# EAGLE design christmas_card (EAGLE 9.6.2)

## Sheet 1 of 2
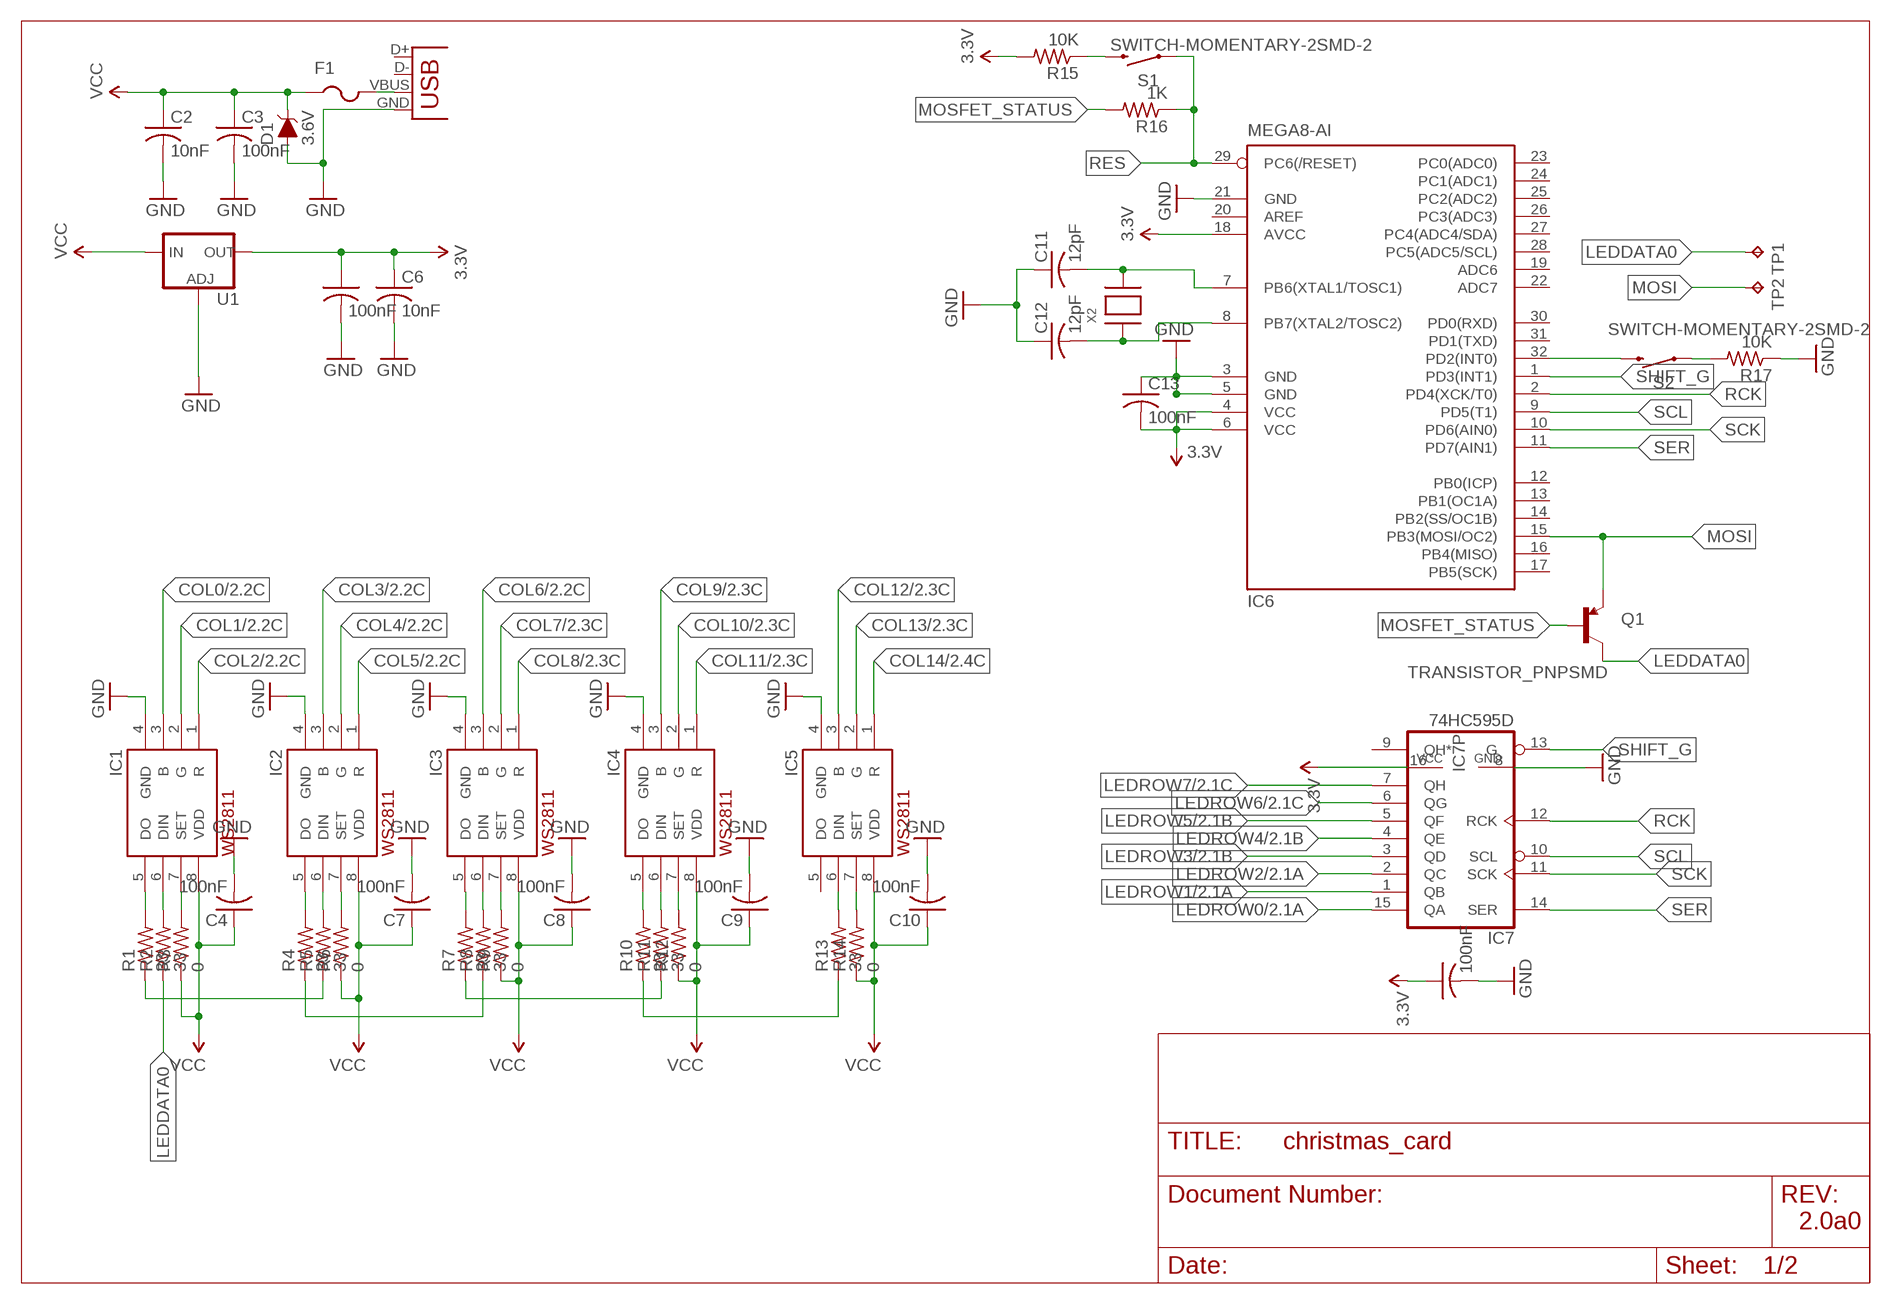
[diagram p0: schematic, sheet 1]

### Parts
C2  10nF  C-USC0603  [C0603]
C3  100nF  C-USC0603  [C0603]
C4  100nF  C-USC0603  [C0603]
C5  100nF  C-USC0603  [C0603]
C6  10nF  C-USC0603  [C0603]
C7  100nF  C-USC0603  [C0603]
C8  100nF  C-USC0603  [C0603]
C9  100nF  C-USC0603  [C0603]
C10  100nF  C-USC0603  [C0603]
C11  12pF  C-USC0603  [C0603]
C12  12pF  C-USC0603  [C0603]
C13  100nF  C-USC0603  [C0603]
C14  100nF  C-USC0603  [C0603]
D1  3.6V  DIODE-ZENER-BZT52C3V6S  [SOD-323]
F1  PTCFUSE-1206  [R1206]
IC1  WS2811-SOP8  [SO08-SKINNYPADS]
IC2  WS2811-SOP8  [SO08-SKINNYPADS]
IC3  WS2811-SOP8  [SO08-SKINNYPADS]
IC4  WS2811-SOP8  [SO08-SKINNYPADS]
IC5  WS2811-SOP8  [SO08-SKINNYPADS]
IC6  MEGA8-AI  [TQFP32-08]
IC7  74HC595D  [SO16]
Q1  TRANSISTOR_PNPSMD  [SOT23-3]
R1  33  R-US_R0603  [R0603]
R2  33  R-US_R0603  [R0603]
R3  0  R-US_R0603  [R0603]
R4  33  R-US_R0603  [R0603]
R5  33  R-US_R0603  [R0603]
R6  0  R-US_R0603  [R0603]
R7  33  R-US_R0603  [R0603]
R8  33  R-US_R0603  [R0603]
R9  0  R-US_R0603  [R0603]
R10  33  R-US_R0603  [R0603]
R11  33  R-US_R0603  [R0603]
R12  0  R-US_R0603  [R0603]
R13  33  R-US_R0603  [R0603]
R14  0  R-US_R0603  [R0603]
R15  10K  R-US_R0603  [R0603]
R16  1K  R-US_R0603  [R0603]
R17  10K  R-US_R0603  [R0603]
S1  SWITCH-MOMENTARY-2SMD-2  [TACTILE_SWITCH_SMD-2]
S2  SWITCH-MOMENTARY-2SMD-2  [TACTILE_SWITCH_SMD-2]
TP1  TPB1,27  [B1,27]
TP2  TPB1,27  [B1,27]
U1  V_REG_LM1117SOT223  [SOT223]
X1  USB-MICROB  [USB-MICROB]
X2  XTALNX5032  [NX5032]

### Nets
3.3V: C5.1 C6.1 C13.2 C14.1 IC6.4(VCC) IC6.6(VCC) IC6.18(AVCC) IC7.16(VCC) R15.2 U1.2(OUT) U1.4(OUT)
COL0: IC1.3(B) ; also sheet 2
COL1: IC1.2(G) ; also sheet 2
COL2: IC1.1(R) ; also sheet 2
COL3: IC2.3(B) ; also sheet 2
COL4: IC2.2(G) ; also sheet 2
COL5: IC2.1(R) ; also sheet 2
COL6: IC3.3(B) ; also sheet 2
COL7: IC3.2(G) ; also sheet 2
COL8: IC3.1(R) ; also sheet 2
COL9: IC4.3(B) ; also sheet 2
COL10: IC4.2(G) ; also sheet 2
COL11: IC4.1(R) ; also sheet 2
COL12: IC5.3(B) ; also sheet 2
COL13: IC5.2(G) ; also sheet 2
COL14: IC5.1(R) ; also sheet 2
GND: C2.2 C3.2 C4.2 C5.2 C6.2 C7.2 C8.2 C9.2 C10.2 C11.1 C12.1 C13.1 C14.2 D1.A IC1.4(GND) IC2.4(GND) IC3.4(GND) IC4.4(GND) IC5.4(GND) IC6.3(GND) IC6.5(GND) IC6.21(GND) IC7.8(GND) R17.1 U1.1(ADJ) X1.GND
LEDATA1: R7.1 R11.1
LEDDATA0: Q1.3(C) R2.1 TP1.TP
LEDROW0: IC7.15(QA) ; also sheet 2
LEDROW1: IC7.1(QB) ; also sheet 2
LEDROW2: IC7.2(QC) ; also sheet 2
LEDROW3: IC7.3(QD) ; also sheet 2
LEDROW4: IC7.4(QE) ; also sheet 2
LEDROW5: IC7.5(QF) ; also sheet 2
LEDROW6: IC7.6(QG) ; also sheet 2
LEDROW7: IC7.7(QH) ; also sheet 2
MOSFET_STATUS: Q1.1(B) R16.2
MOSI: IC6.15(PB3(MOSI/OC2)) Q1.2(E) TP2.TP
N$1: R1.1 R5.1
N$2: IC1.5(DO) R1.2
N$3: IC2.6(DIN) R5.2
N$4: IC2.5(DO) R4.2
N$5: R4.1 R8.1
N$6: IC3.6(DIN) R8.2
N$7: IC1.6(DIN) R2.2
N$8: IC3.7(SET) R9.2
N$9: R15.1 S1.1
N$10: C11.2 IC6.7(PB6(XTAL1/TOSC1)) X2.P$2
N$11: IC6.32(PD2(INT0)) S2.1
N$12: R17.2 S2.2
N$14: C12.2 IC6.8(PB7(XTAL2/TOSC2)) X2.P$1
N$24: R10.1 R13.1
N$32: IC4.6(DIN) R11.2
N$33: IC4.7(SET) R12.2
N$34: IC3.5(DO) R7.2
N$35: IC2.7(SET) R6.2
N$36: IC1.7(SET) R3.2
N$37: IC5.6(DIN) R13.2
N$38: IC5.7(SET) R14.2
N$41: F1.2 X1.VBUS
N$42: IC4.5(DO) R10.2
RCK: IC6.2(PD4(XCK/T0)) IC7.12(RCK)
RES: IC6.29(PC6(/RESET)) R16.1 S1.2
SCK: IC6.10(PD6(AIN0)) IC7.11(SCK)
SCL: IC6.9(PD5(T1)) IC7.10(SCL)
SER: IC6.11(PD7(AIN1)) IC7.14(SER)
SHIFT_G: IC6.1(PD3(INT1)) IC7.13(G)
VCC: C2.1 C3.1 C4.1 C7.1 C8.1 C9.1 C10.1 D1.C F1.1 IC1.8(VDD) IC2.8(VDD) IC3.8(VDD) IC4.8(VDD) IC5.8(VDD) R3.1 R6.1 R9.1 R12.1 R14.1 U1.3(IN)
Unconnected: IC5.5(DO) IC6.12(PB0(ICP)) IC6.13(PB1(OC1A)) IC6.14(PB2(SS/OC1B)) IC6.16(PB4(MISO)) IC6.17(PB5(SCK)) IC6.19(ADC6) IC6.20(AREF) IC6.22(ADC7) IC6.23(PC0(ADC0)) IC6.24(PC1(ADC1)) IC6.25(PC2(ADC2)) IC6.26(PC3(ADC3)) IC6.27(PC4(ADC4/SDA)) IC6.28(PC5(ADC5/SCL)) IC6.30(PD0(RXD)) IC6.31(PD1(TXD)) IC7.9(QH*) X1.D+ X1.D-

### Notes on the sheet
- 2.0a0

## Sheet 2 of 2
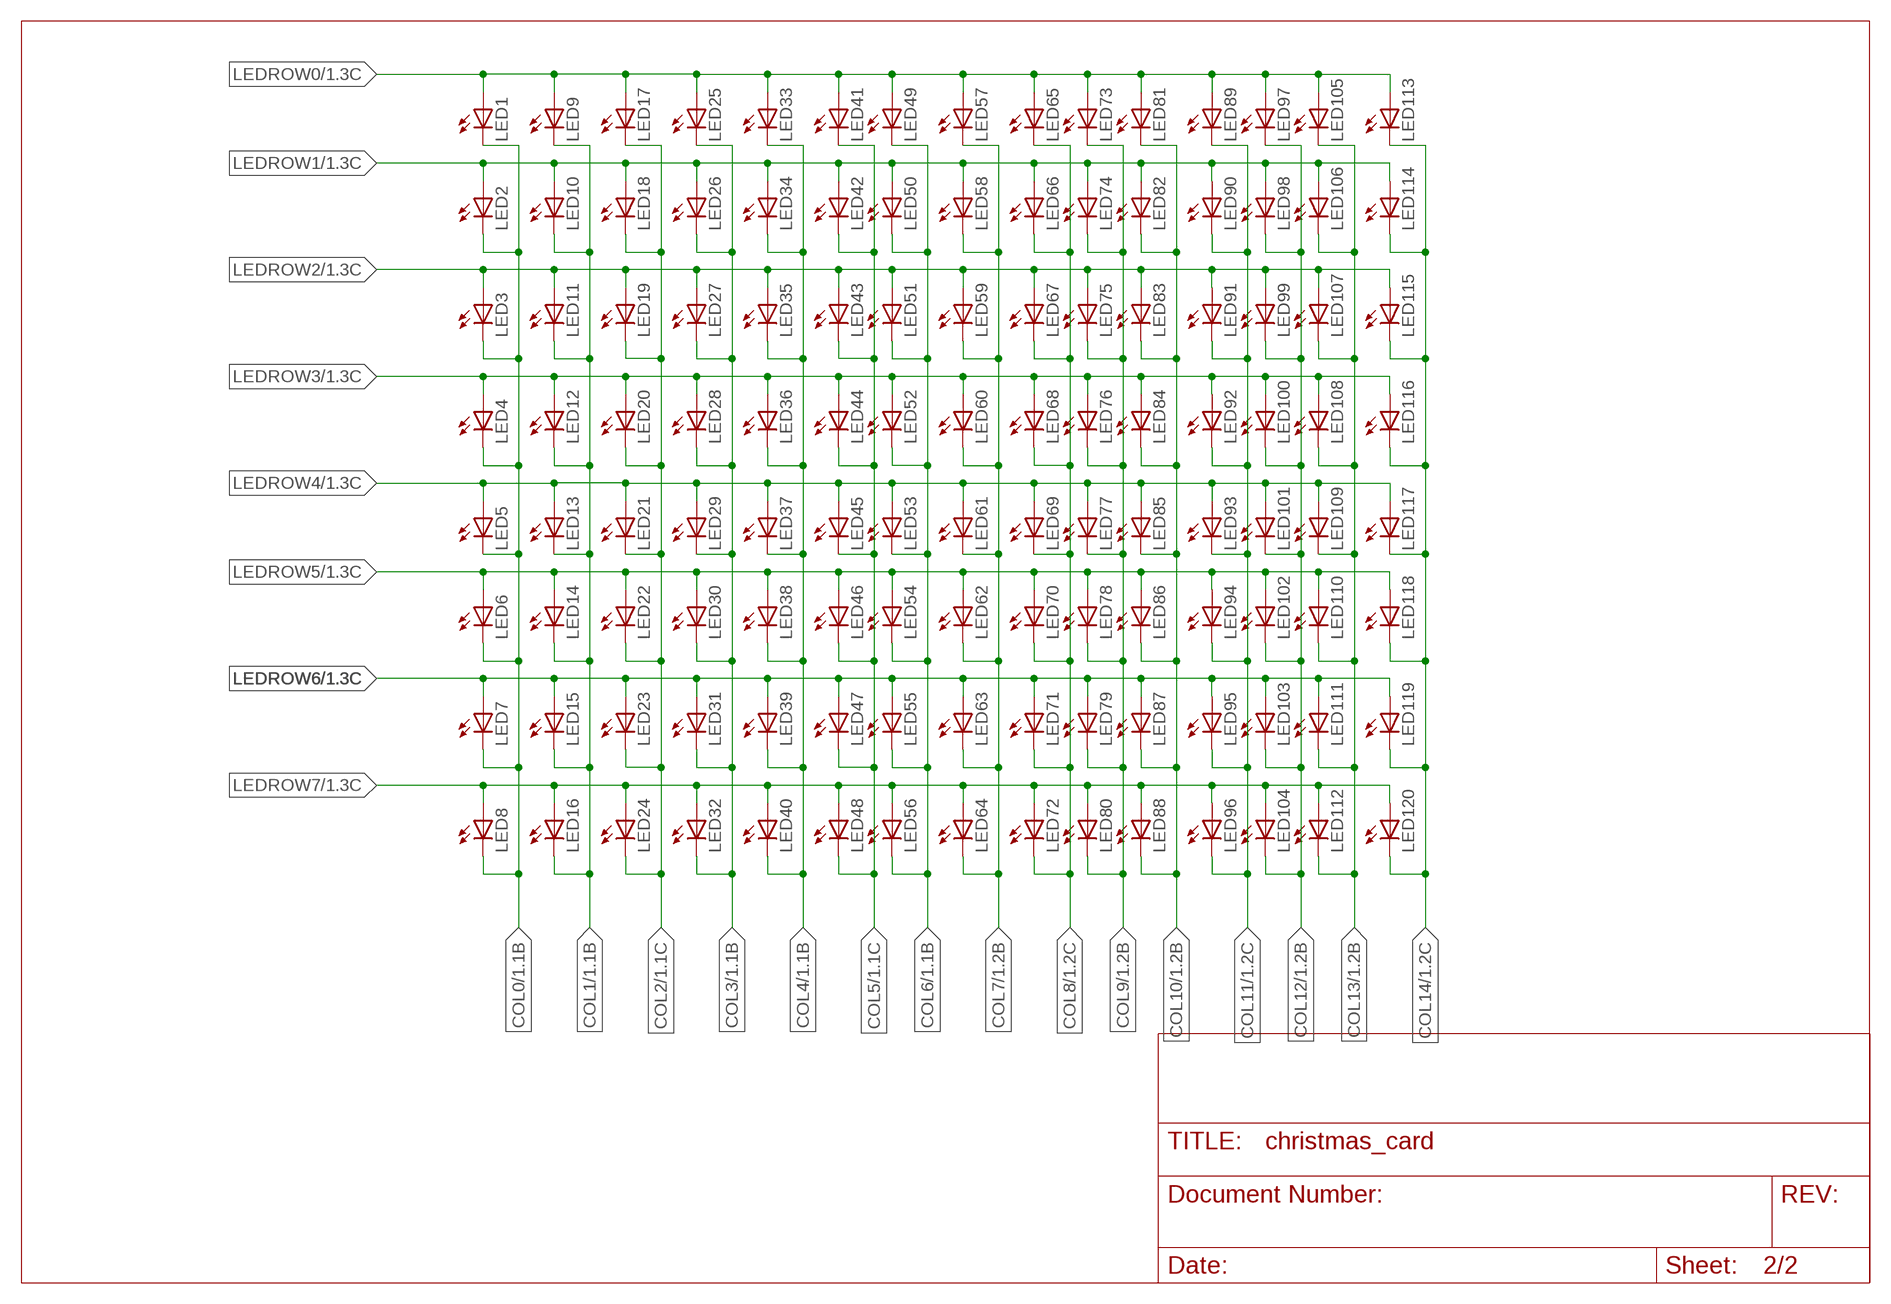
[diagram p1: schematic, sheet 2]

### Parts
LED1  LED1206  [LED-1206]
LED2  LED1206  [LED-1206]
LED3  LED1206  [LED-1206]
LED4  LED1206  [LED-1206]
LED5  LED1206  [LED-1206]
LED6  LED1206  [LED-1206]
LED7  LED1206  [LED-1206]
LED8  LED1206  [LED-1206]
LED9  LED1206  [LED-1206]
LED10  LED1206  [LED-1206]
LED11  LED1206  [LED-1206]
LED12  LED1206  [LED-1206]
LED13  LED1206  [LED-1206]
LED14  LED1206  [LED-1206]
LED15  LED1206  [LED-1206]
LED16  LED1206  [LED-1206]
LED17  LED1206  [LED-1206]
LED18  LED1206  [LED-1206]
LED19  LED1206  [LED-1206]
LED20  LED1206  [LED-1206]
LED21  LED1206  [LED-1206]
LED22  LED1206  [LED-1206]
LED23  LED1206  [LED-1206]
LED24  LED1206  [LED-1206]
LED25  LED1206  [LED-1206]
LED26  LED1206  [LED-1206]
LED27  LED1206  [LED-1206]
LED28  LED1206  [LED-1206]
LED29  LED1206  [LED-1206]
LED30  LED1206  [LED-1206]
LED31  LED1206  [LED-1206]
LED32  LED1206  [LED-1206]
LED33  LED1206  [LED-1206]
LED34  LED1206  [LED-1206]
LED35  LED1206  [LED-1206]
LED36  LED1206  [LED-1206]
LED37  LED1206  [LED-1206]
LED38  LED1206  [LED-1206]
LED39  LED1206  [LED-1206]
LED40  LED1206  [LED-1206]
LED41  LED1206  [LED-1206]
LED42  LED1206  [LED-1206]
LED43  LED1206  [LED-1206]
LED44  LED1206  [LED-1206]
LED45  LED1206  [LED-1206]
LED46  LED1206  [LED-1206]
LED47  LED1206  [LED-1206]
LED48  LED1206  [LED-1206]
LED49  LED1206  [LED-1206]
LED50  LED1206  [LED-1206]
LED51  LED1206  [LED-1206]
LED52  LED1206  [LED-1206]
LED53  LED1206  [LED-1206]
LED54  LED1206  [LED-1206]
LED55  LED1206  [LED-1206]
LED56  LED1206  [LED-1206]
LED57  LED1206  [LED-1206]
LED58  LED1206  [LED-1206]
LED59  LED1206  [LED-1206]
LED60  LED1206  [LED-1206]
LED61  LED1206  [LED-1206]
LED62  LED1206  [LED-1206]
LED63  LED1206  [LED-1206]
LED64  LED1206  [LED-1206]
LED65  LED1206  [LED-1206]
LED66  LED1206  [LED-1206]
LED67  LED1206  [LED-1206]
LED68  LED1206  [LED-1206]
LED69  LED1206  [LED-1206]
LED70  LED1206  [LED-1206]
LED71  LED1206  [LED-1206]
LED72  LED1206  [LED-1206]
LED73  LED1206  [LED-1206]
LED74  LED1206  [LED-1206]
LED75  LED1206  [LED-1206]
LED76  LED1206  [LED-1206]
LED77  LED1206  [LED-1206]
LED78  LED1206  [LED-1206]
LED79  LED1206  [LED-1206]
LED80  LED1206  [LED-1206]
LED81  LED1206  [LED-1206]
LED82  LED1206  [LED-1206]
LED83  LED1206  [LED-1206]
LED84  LED1206  [LED-1206]
LED85  LED1206  [LED-1206]
LED86  LED1206  [LED-1206]
LED87  LED1206  [LED-1206]
LED88  LED1206  [LED-1206]
LED89  LED1206  [LED-1206]
LED90  LED1206  [LED-1206]
LED91  LED1206  [LED-1206]
LED92  LED1206  [LED-1206]
LED93  LED1206  [LED-1206]
LED94  LED1206  [LED-1206]
LED95  LED1206  [LED-1206]
LED96  LED1206  [LED-1206]
LED97  LED1206  [LED-1206]
LED98  LED1206  [LED-1206]
LED99  LED1206  [LED-1206]
LED100  LED1206  [LED-1206]
LED101  LED1206  [LED-1206]
LED102  LED1206  [LED-1206]
LED103  LED1206  [LED-1206]
LED104  LED1206  [LED-1206]
LED105  LED1206  [LED-1206]
LED106  LED1206  [LED-1206]
LED107  LED1206  [LED-1206]
LED108  LED1206  [LED-1206]
LED109  LED1206  [LED-1206]
LED110  LED1206  [LED-1206]
LED111  LED1206  [LED-1206]
LED112  LED1206  [LED-1206]
LED113  LED1206  [LED-1206]
LED114  LED1206  [LED-1206]
LED115  LED1206  [LED-1206]
LED116  LED1206  [LED-1206]
LED117  LED1206  [LED-1206]
LED118  LED1206  [LED-1206]
LED119  LED1206  [LED-1206]
LED120  LED1206  [LED-1206]

### Nets
COL0: LED1.C LED2.C LED3.C LED4.C LED5.C LED6.C LED7.C LED8.C ; also sheet 1
COL1: LED9.C LED10.C LED11.C LED12.C LED13.C LED14.C LED15.C LED16.C ; also sheet 1
COL2: LED17.C LED18.C LED19.C LED20.C LED21.C LED22.C LED23.C LED24.C ; also sheet 1
COL3: LED25.C LED26.C LED27.C LED28.C LED29.C LED30.C LED31.C LED32.C ; also sheet 1
COL4: LED33.C LED34.C LED35.C LED36.C LED37.C LED38.C LED39.C LED40.C ; also sheet 1
COL5: LED41.C LED42.C LED43.C LED44.C LED45.C LED46.C LED47.C LED48.C ; also sheet 1
COL6: LED49.C LED50.C LED51.C LED52.C LED53.C LED54.C LED55.C LED56.C ; also sheet 1
COL7: LED57.C LED58.C LED59.C LED60.C LED61.C LED62.C LED63.C LED64.C ; also sheet 1
COL8: LED65.C LED66.C LED67.C LED68.C LED69.C LED70.C LED71.C LED72.C ; also sheet 1
COL9: LED73.C LED74.C LED75.C LED76.C LED77.C LED78.C LED79.C LED80.C ; also sheet 1
COL10: LED81.C LED82.C LED83.C LED84.C LED85.C LED86.C LED87.C LED88.C ; also sheet 1
COL11: LED89.C LED90.C LED91.C LED92.C LED93.C LED94.C LED95.C LED96.C ; also sheet 1
COL12: LED97.C LED98.C LED99.C LED100.C LED101.C LED102.C LED103.C LED104.C ; also sheet 1
COL13: LED105.C LED106.C LED107.C LED108.C LED109.C LED110.C LED111.C LED112.C ; also sheet 1
COL14: LED113.C LED114.C LED115.C LED116.C LED117.C LED118.C LED119.C LED120.C ; also sheet 1
LEDROW0: LED1.A LED9.A LED17.A LED25.A LED33.A LED41.A LED49.A LED57.A LED65.A LED73.A LED81.A LED89.A LED97.A LED105.A LED113.A ; also sheet 1
LEDROW1: LED2.A LED10.A LED18.A LED26.A LED34.A LED42.A LED50.A LED58.A LED66.A LED74.A LED82.A LED90.A LED98.A LED106.A LED114.A ; also sheet 1
LEDROW2: LED3.A LED11.A LED19.A LED27.A LED35.A LED43.A LED51.A LED59.A LED67.A LED75.A LED83.A LED91.A LED99.A LED107.A LED115.A ; also sheet 1
LEDROW3: LED4.A LED12.A LED20.A LED28.A LED36.A LED44.A LED52.A LED60.A LED68.A LED76.A LED84.A LED92.A LED100.A LED108.A LED116.A ; also sheet 1
LEDROW4: LED5.A LED13.A LED21.A LED29.A LED37.A LED45.A LED53.A LED61.A LED69.A LED77.A LED85.A LED93.A LED101.A LED109.A LED117.A ; also sheet 1
LEDROW5: LED6.A LED14.A LED22.A LED30.A LED38.A LED46.A LED54.A LED62.A LED70.A LED78.A LED86.A LED94.A LED102.A LED110.A LED118.A ; also sheet 1
LEDROW6: LED7.A LED15.A LED23.A LED31.A LED39.A LED47.A LED55.A LED63.A LED71.A LED79.A LED87.A LED95.A LED103.A LED111.A LED119.A ; also sheet 1
LEDROW7: LED8.A LED16.A LED24.A LED32.A LED40.A LED48.A LED56.A LED64.A LED72.A LED80.A LED88.A LED96.A LED104.A LED112.A LED120.A ; also sheet 1

## Library data of the parts
C2-C14 = adafruit:C-US: CAPACITOR, American symbol
D1 = SparkFun-DiscreteSemi:DIODE-ZENER: Zener Diode A Zener diode allows current to flow from its anode to its cathode like a normal semiconductor diode, but it also permits current to flow in the reverse direction when its "Zener voltage" is reached. - WIkipedia; PROD_ID: DIO-08199
F1 = adafruit:PTCFUSE: PTC fuses, resettable thermistors
IC1-IC5 = adafruit:WS2811
IC6 = atmel:MEGA8: MICROCONTROLLER 8 Kbytes FLASH, 1 kbytes SRAM, 512 bytes EEPROM, USART, 6-channel 10 bit ADC, 2-channel 8 bit ADC Pin compatible with Atmega48, ATMega88, ATMega168 Source: avr.lbr; MPN: ATMEGA8-16AU; OC_FARNELL: 9171371; OC_NEWARK: 73M8863
IC7 = 74xx-eu:74*595: 8-bit SHIFT REGISTER, output latch
LED1-LED120 = SparkFun:LED: LEDs Standard schematic elements and footprints for 5mm, 3mm, 1206, and 0603 sized LEDs. 5mm - Spark Fun Electronics SKU : COM-00529 (and others)
Q1 = SparkFun:TRANSISTOR_PNP
R1-R17 = adafruit:R-US_: RESISTOR, American symbol
S1 S2 = SparkFun:SWITCH-MOMENTARY-2
TP1 TP2 = testpad:TP: Test pad
U1 = SparkFun-IC-Power:V_REG_LM1117: Voltage Regulator LM1117 Standard adjustable voltage regulator but in SMD form. Spark Fun Electronics SKU : COM-00595; PROD_ID: VREG-08170
X1 = SparkFun:USB: USB Connectors USB-B-PTH is fully proven SKU : PRT-00139 USB-miniB is fully proven SKU : PRT-00587 USB-A-PCB is untested. USB-A-H is throughly reviewed, but untested. Spark Fun Electronics SKU : PRT-00437 USB-B-SMT is throughly reviewed, but untested. Needs silkscreen touching up. USB-A-S has not been used/tested USB-MB-H has not been used/tested
X2 = adafruit:XTAL: Low cost SMT crystals, no capacitors included http://www.ladyada.net/library/eagle

## Board
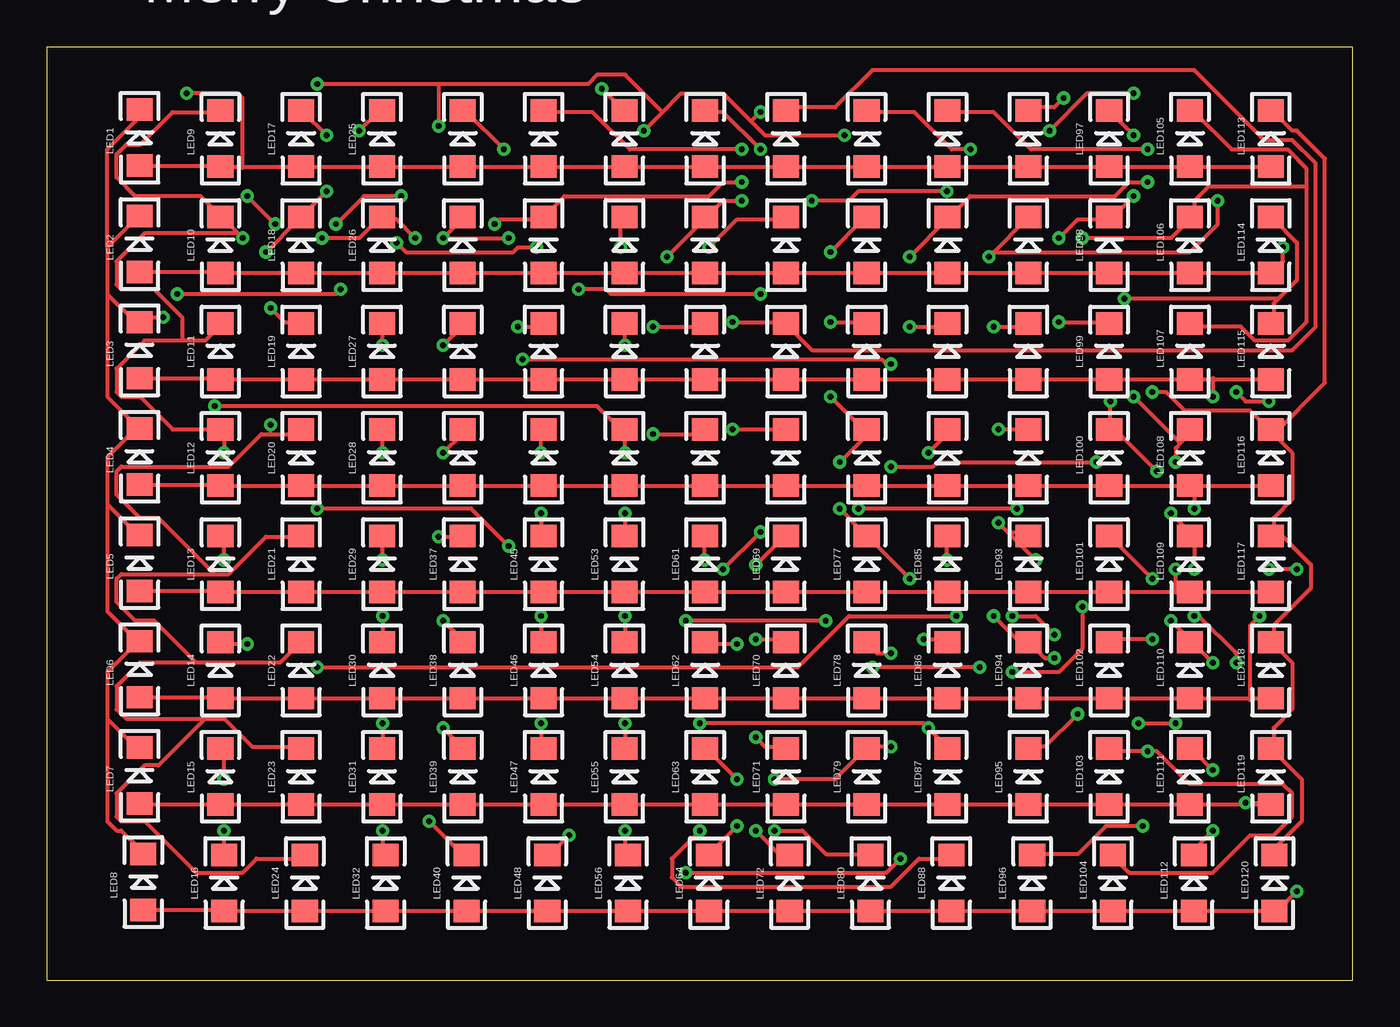
[diagram p2: board, top side]
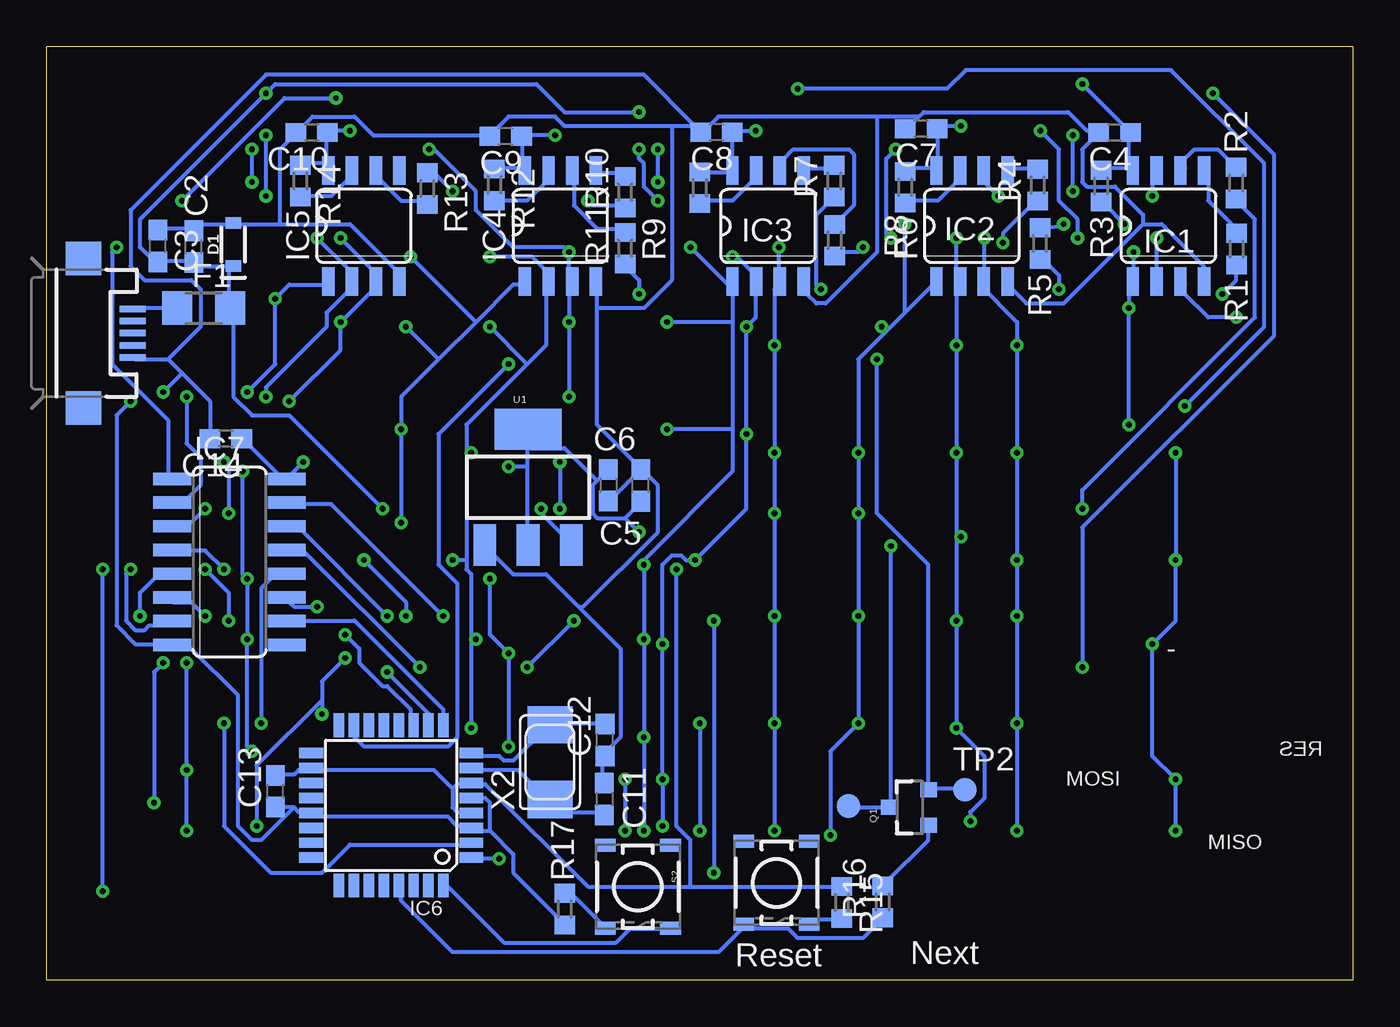
[diagram p3: board, bottom side, seen from below]

Size 70 x 50 mm. Coordinates in mm from the lower left corner, seen from the top.
Outline: 0,0 70,0 70,50 0,50 0,0
Copper layers (1*16): Top 0.035mm / dielectric 1.5mm / Bottom 0.035mm
Design rules "default *": minimum track width 8mil, minimum drill 12mil, track to track 8mil, track to pad 8mil, pad to pad 8mil, via to via 8mil, smd to smd 8mil, copper to edge 40mil, drill to drill 8mil, minimum pad ring 10mil, minimum via ring 8mil, stop-mask expansion 4mil, vias tented up to drill 12mil, thermal gap 10mil

### Footprints (pad centres in the part's own frame; a part is rotated, then mirrored left to right if it is on the bottom)
C0603 = smd 1.1 x 1: 1 -0.85,0; 2 0.85,0
SOD-323 = smd 0.63 x 0.83: A 1.15,0; C -1.15,0
R1206 = smd 1.6 x 1.803: 1 -1.422,0; 2 1.422,0
SO08-SKINNYPADS = smd 0.66 x 1.524: 1 -1.905,-2.973; 2 -0.635,-2.973; 3 0.635,-2.973; 4 1.905,-2.973; 5 1.905,2.973; 6 0.635,2.973; 7 -0.635,2.973; 8 -1.905,2.973
TQFP32-08 = smd 1.27 x 0.559: 1 -4.293,2.8; 2 -4.293,2; 3 -4.293,1.2; 4 -4.293,0.4; 5 -4.293,-0.4; 6 -4.293,-1.2; 7 -4.293,-2; 8 -4.293,-2.8; 17 4.293,-2.8; 18 4.293,-2; 19 4.293,-1.2; 20 4.293,-0.4; 21 4.293,0.4; 22 4.293,1.2; 23 4.293,2; 24 4.293,2.8 | smd 0.559 x 1.27: 9 -2.8,-4.293; 10 -2,-4.293; 11 -1.2,-4.293; 12 -0.4,-4.293; 13 0.4,-4.293; 14 1.2,-4.293; 15 2,-4.293; 16 2.8,-4.293; 25 2.8,4.293; 26 2,4.293; 27 1.2,4.293; 28 0.4,4.293; 29 -0.4,4.293; 30 -1.2,4.293; 31 -2,4.293; 32 -2.8,4.293
SO16 = smd 0.66 x 2.032: 1 -4.445,-3.073; 2 -3.175,-3.073; 3 -1.905,-3.073; 4 -0.635,-3.073; 5 0.635,-3.073; 6 1.905,-3.073; 7 3.175,-3.073; 8 4.445,-3.073; 9 4.445,3.073; 10 3.175,3.073; 11 1.905,3.073; 12 0.635,3.073; 13 -0.635,3.073; 14 -1.905,3.073; 15 -3.175,3.073; 16 -4.445,3.073
LED-1206 = smd 1.2 x 1.4: A -1.5,0; C 1.5,0
SOT23-3 = smd 0.8 x 0.9: 1 -0.95,-1; 2 0.95,-1; 3 0,1.1
R0603 = smd 1 x 1.1: 1 -0.85,0; 2 0.85,0
TACTILE_SWITCH_SMD-2 = smd 0.7 x 1.1: 1 2.225,1.75; 2 2.225,-1.75; 3 -2.225,-1.75; 4 -2.225,1.75
B1,27 = smd 1.27 x 1.27: TP 0,0
SOT223 = smd 1.219 x 2.235: 1 -2.311,-3.099; 2 0,-3.099; 3 2.311,-3.099 | smd 3.6 x 2.2: 4 0,3.099
USB-MICROB = smd 0.35 x 1.4: D+ 0,2.65; D- -0.65,2.65; GND 1.3,2.65; ID 0.65,2.65; VBUS -1.3,2.65 | smd 1.8 x 1.9: MT1 -4,0; MT2 4,0
NX5032 = smd 2 x 2.4: P$1 2,0; P$2 -2,0

### Placement (x,y rotation side)
C2  62.11,39.29 90 bottom
C3  64.03,39.32 90 bottom
C4  12.77,45.4 180 bottom
C5  38.16,26.5 90 bottom
C6  39.9,26.5 270 bottom
C7  23.13,45.6 180 bottom
C8  34.1,45.42 180 bottom
C9  45.4,45.2 180 bottom
C10  55.8,45.4 180 bottom
C11  40.12,9.69 270 bottom
C12  40.07,12.86 90 bottom
C13  57.73,10.11 90 bottom
C14  60.4,29 180 bottom
D1  60,39.4 90 bottom
F1  61.59,35.99 180 bottom
IC1  9.88,40.4 0 bottom
IC2  20.41,40.4 0 bottom
IC3  31.34,40.4 0 bottom
IC4  42.47,40.4 0 bottom
IC5  53,40.4 0 bottom
IC6  51.53,9.35 180 bottom
IC7  60.2,22.4 270 bottom
LED1  4.98,45.13 90 top
LED2  4.98,39.43 90 top
LED3  4.98,33.73 90 top
LED4  4.98,28.04 90 top
LED5  4.98,22.34 90 top
LED6  4.98,16.65 90 top
LED7  4.98,10.95 90 top
LED8  5.18,5.25 90 top
LED9  9.31,45.07 90 top
LED10  9.31,39.38 90 top
LED11  9.31,33.68 90 top
LED12  9.31,27.98 90 top
LED13  9.31,22.29 90 top
LED14  9.31,16.59 90 top
LED15  9.31,10.9 90 top
LED16  9.51,5.2 90 top
LED17  13.64,45.07 90 top
LED18  13.64,39.38 90 top
LED19  13.64,33.68 90 top
LED20  13.64,27.98 90 top
LED21  13.64,22.29 90 top
LED22  13.64,16.59 90 top
LED23  13.64,10.9 90 top
LED24  13.84,5.2 90 top
LED25  17.97,45.07 90 top
LED26  17.97,39.38 90 top
LED27  17.97,33.68 90 top
LED28  17.97,27.98 90 top
LED29  17.97,22.29 90 top
LED30  17.97,16.59 90 top
LED31  17.97,10.9 90 top
LED32  18.17,5.2 90 top
LED33  22.3,45.07 90 top
LED34  22.3,39.38 90 top
LED35  22.3,33.68 90 top
LED36  22.3,27.98 90 top
LED37  22.3,22.29 90 top
LED38  22.3,16.59 90 top
LED39  22.3,10.9 90 top
LED40  22.5,5.2 90 top
LED41  26.63,45.07 90 top
LED42  26.63,39.38 90 top
LED43  26.63,33.68 90 top
LED44  26.63,27.98 90 top
LED45  26.63,22.29 90 top
LED46  26.63,16.59 90 top
LED47  26.63,10.9 90 top
LED48  26.83,5.2 90 top
LED49  30.96,45.07 90 top
LED50  30.96,39.38 90 top
LED51  30.96,33.68 90 top
LED52  30.96,27.98 90 top
LED53  30.96,22.29 90 top
LED54  30.96,16.59 90 top
LED55  30.96,10.9 90 top
LED56  31.16,5.2 90 top
LED57  35.29,45.07 90 top
LED58  35.29,39.38 90 top
LED59  35.29,33.68 90 top
LED60  35.29,27.98 90 top
LED61  35.29,22.29 90 top
LED62  35.29,16.59 90 top
LED63  35.29,10.9 90 top
LED64  35.49,5.2 90 top
LED65  39.62,45.07 90 top
LED66  39.62,39.38 90 top
LED67  39.62,33.68 90 top
LED68  39.62,27.98 90 top
LED69  39.62,22.29 90 top
LED70  39.62,16.59 90 top
LED71  39.62,10.9 90 top
LED72  39.82,5.2 90 top
LED73  43.95,45.07 90 top
LED74  43.95,39.38 90 top
LED75  43.95,33.68 90 top
LED76  43.95,27.98 90 top
LED77  43.95,22.29 90 top
LED78  43.95,16.59 90 top
LED79  43.95,10.9 90 top
LED80  44.15,5.2 90 top
LED81  48.28,45.07 90 top
LED82  48.28,39.38 90 top
LED83  48.28,33.68 90 top
LED84  48.28,27.98 90 top
LED85  48.28,22.29 90 top
LED86  48.28,16.59 90 top
LED87  48.28,10.9 90 top
LED88  48.48,5.2 90 top
LED89  52.61,45.07 90 top
LED90  52.61,39.38 90 top
LED91  52.61,33.68 90 top
LED92  52.61,27.98 90 top
LED93  52.61,22.29 90 top
LED94  52.61,16.59 90 top
LED95  52.61,10.9 90 top
LED96  52.81,5.2 90 top
LED97  56.94,45.07 90 top
LED98  56.94,39.38 90 top
LED99  56.94,33.68 90 top
LED100  56.94,27.98 90 top
LED101  56.94,22.29 90 top
LED102  56.94,16.59 90 top
LED103  56.94,10.9 90 top
LED104  57.14,5.2 90 top
LED105  61.27,45.07 90 top
LED106  61.27,39.38 90 top
LED107  61.27,33.68 90 top
LED108  61.27,27.98 90 top
LED109  61.27,22.29 90 top
LED110  61.27,16.59 90 top
LED111  61.27,10.9 90 top
LED112  61.47,5.2 90 top
LED113  65.6,45.07 90 top
LED114  65.6,39.38 90 top
LED115  65.6,33.68 90 top
LED116  65.6,27.98 90 top
LED117  65.6,22.29 90 top
LED118  65.6,16.59 90 top
LED119  65.6,10.9 90 top
LED120  65.8,5.2 90 top
Q1  23.73,9.25 90 bottom
R1  6.23,39.15 90 bottom
R2  6.25,42.69 90 bottom
R3  13.49,42.53 270 bottom
R4  16.89,42.59 90 bottom
R5  16.77,39.45 90 bottom
R6  23.99,42.47 270 bottom
R7  27.8,42.8 90 bottom
R8  27.77,39.63 90 bottom
R9  34.99,42.44 270 bottom
R10  39,42.2 90 bottom
R11  39,39.2 90 bottom
R12  46,42.6 270 bottom
R13  49.6,42.4 270 bottom
R14  56.4,42.8 270 bottom
R15  27.38,4.15 90 bottom
R16  25.2,4.18 90 bottom
R17  42.23,3.8 90 bottom
S1  30.88,5.2 270 bottom
S2  38.32,5 270 bottom
TP1  27.04,9.32 0 bottom
TP2  20.8,10.2 0 bottom
U1  44.2,26.4 0 bottom
X1  68.03,34.65 270 bottom
X2  43.03,11.68 90 bottom

### Tracks (layer width: path | path; a pad name or v marks a point on that pad's centre or on a via)
3.3V  (via drill 0.3)
  Top 0.203: v56.25,27.75 47.75,27.75 47.5,27.5 v45.25,27.5 | v36.25,22 v38.25,24
  Bottom 0.203: C14.1 59.5,29 57.25,26.75 IC7.16 57,27 v56.25,27.75 | 39,24.75 38.25,25.5 C5.1 | 39,24.75 40.5,24.75 40.75,25 40.75,26.5 40.5,26.75 | 40.5,26.75 40,27.25 C6.1 | 44.25,28.5 44.25,29.25 U1.4 44.25,28.5 | 44.25,28.5 44.25,27.5 | 44.25,27.5 44.25,23.5 U1.2 | 40.5,26.75 42.25,28.5 44.25,28.5 | 44.25,27.5 v45.25,27.5 | C13.2 57.5,11 56.75,11 56.5,11.25 56,11.25 IC6.18 55.75,11.25 49.25,11.25 48.25,10.25 | 35.5,5 41,5 46.5,10.5 47,10.5 IC6.6 47.25,10.5 48,10.5 48.25,10.25 | 35.5,5 27.5,5 R15.2 | 48.25,10.25 48.25,9.25 48,9 47.25,9 IC6.4 | v38.25,24 39,24.75 | v36.25,22 36.25,8.25 35.5,7.5 35.5,5
COL0  (via drill 0.3)
  Top 0.203: 3.25,14 4.75,12.5 LED7.C | 3.25,14 3.25,16.5 4.75,18 LED6.C 4.75,18.25 3.25,19.75 3.25,25.5 | 3.25,14 3.25,8.5 3.75,8 4,8 5,7 LED8.C | 3.25,25.5 4.75,24 LED5.C | 3.25,25.5 3.25,28 4.75,29.5 LED4.C 4.75,29.75 3.25,31.25 3.25,36.75 | 3.25,36.75 4.5,35.5 | 4.5,35.5 4.75,35.25 LED3.C 4.5,35.5 | 3.25,39.25 3.25,36.75 | 3.25,39.25 4.75,40.75 LED2.C | 3.25,39.25 3.25,44.5 4.75,46 4.75,46.5 LED1.C | 4.5,35.5 v6.25,35.5
  Bottom 0.203: v6.25,35.5 7.75,35.5 9,36.75 9,37.25 IC1.3
COL1  (via drill 0.3)
  Top 0.203: v9.5,10.75 9.5,12.25 LED15.C | v9.5,8 9.5,6.75 LED16.C | v10.75,18 9.5,18 LED14.C | v9.5,22.5 9.5,23.75 LED13.C | 7.25,34.25 8.5,34.25 9.25,35 LED11.C | 7.25,34.25 5.25,34.25 3.75,32.75 3.75,31.5 4,31.25 5,31.25 6.75,29.5 9.25,29.5 LED12.C 9.5,29.25 v9.5,28.25 | 10.25,40 9.5,40.75 LED10.C 9.25,41 8.25,42 4.75,42 3.75,43 3.75,44.25 4.25,44.75 5,44.75 6.75,46.5 9.25,46.5 LED9.C | 7.25,34.25 7.25,35.5 5.75,37 4,37 3.75,37.25 3.75,38.5 5.25,40 10.25,40 | 10.25,40 v10.5,39.75
  Bottom 0.203: v9.5,8 v9.5,10.75 10.75,12 v10.75,18 9.5,19.25 v9.5,22.5 v9.5,28.25 | v10.5,39.75 10.5,37.5 IC1.2
COL2  (via drill 0.3)
  Top 0.203: v12,36 12.75,35.25 13.5,35.25 LED19.C | v11.75,39 13.5,40.75 LED18.C 13.75,41 v15,42.25 | v15,45.25 13.75,46.5 LED17.C | 8.5,14 4.25,14 3.75,14.5 3.75,15.75 5,17 8,17 | 8.5,14 9.5,14 11,12.5 13.5,12.5 LED23.C | 8,17 12.5,17 13.5,18 LED22.C | 9,21.75 4,21.75 3.75,21.5 3.75,20.25 4.75,19.25 5.75,19.25 8,17 | 9,21.75 9.75,21.75 11.75,23.75 13.5,23.75 LED21.C | 12,29.25 11.5,29.25 9.75,27.5 4,27.5 3.75,27.25 3.75,26 5,24.75 6,24.75 9,21.75 | 12,29.25 13.5,29.25 LED20.C | 8.5,14 6,11.5 5.25,11.5 3.75,10 3.75,8.75 4,8.5 5.25,8.5 8,5.75 10.5,5.75 11.25,6.5 13.75,6.5 LED24.C | 12,29.25 v12,29.75
  Bottom 0.203: v11.75,39 11.75,37.5 IC1.1 12,37.25 v12,36 v12,29.75 | v15,42.25 v15,45.25
COL3  (via drill 0.3)
  Top 0.203: v18,13.75 18,12.5 LED31.C | v18,19.5 18,18.25 LED30.C | v18,22.5 18,23.75 LED29.C | v18,28.25 18,29.25 LED28.C | v18,34 18,35 LED27.C | v19.75,39.75 18.75,40.75 18,40.75 LED26.C 17.75,40.75 16.75,39.75 v14.75,39.75 | v16.75,45.5 17.75,46.5 LED25.C | v18,8 18,6.75 LED32.C
  Bottom 0.203: v19.75,39.75 19.75,37.5 IC2.3 20,37.25 18,35.25 v18,34 v18,28.25 v18,22.5 v18,19.5 v18,13.75 v18,8 | v16.75,45.5 15.75,44.5 15.75,41.75 14.75,40.75 v14.75,39.75
COL4  (via drill 0.3)
  Top 0.203: v21.25,13.5 22.25,12.5 LED39.C | v21.25,19.25 22.25,18.25 LED38.C | v21,23.75 22.25,23.75 LED37.C | v21.25,28.25 22.25,29.25 LED36.C | v20.5,8.5 22.25,6.75 LED40.C | v21.25,34 22.25,35 LED35.C | LED34.C 22.25,40.75 v21.25,39.75 v24.75,39.75 | v24.5,44.5 22.5,46.5 LED33.C
  Bottom 0.203: 21.25,23.75 v21.25,28.25 v21.25,34 21.25,37.25 IC2.2 21.25,37.5 v21.25,39.75 | 21.25,23.75 v21.25,19.25 v21.25,13.5 19.75,12 19.75,9.75 20.5,9 v20.5,8.5 | 21.25,23.75 v21,23.75 | v24.5,44.5 25,44 25,40 v24.75,39.75
COL5  (via drill 0.3)
  Top 0.203: v26.5,13.75 26.5,12.5 LED47.C | v26.5,19.5 26.5,18.25 LED46.C | v26.5,25 26.5,24 LED45.C | v26.5,28.25 26.5,29.25 LED44.C | v25.25,35 26.5,35 LED43.C | v24,40.5 24.25,40.75 26.5,40.75 LED42.C 26.75,41 27.75,42 35.5,42 36.25,42.75 v37.25,42.75 | v37.25,44.5 31.25,44.5 29.25,46.5 26.75,46.5 LED41.C | v28,7.75 27,6.75 LED48.C
  Bottom 0.203: 24,35.75 22.5,37.25 IC2.1 | 24,35.75 25,34.75 | 25,34.75 26.5,33.25 v26.5,28.25 v26.5,25 v26.5,19.5 v26.5,13.75 28,12.25 v28,7.75 | 25,34.75 v25.25,35 | 24,35.75 v24,40.5 | v37.25,42.75 v37.25,44.5
COL6  (via drill 0.3)
  Top 0.203: v31,8 31,6.75 LED56.C | v31,13.75 31,12.5 LED55.C | v31,19.5 31,18.25 LED54.C | v31,25 31,24 LED53.C | v31,28.25 31,29.25 LED52.C 30.75,29.5 29.5,30.75 v9,30.75 | v31,34 31,35 LED51.C | v30.75,39.25 30.75,40.75 LED50.C | v29.75,47.75 30.75,46.75 LED49.C
  Bottom 0.203: v31,8 v31,13.75 v31,19.5 v31,25 v31,28.25 v31,34 31,37 30.75,37.25 IC3.3 30.75,37.5 v30.75,39.25 | v29.75,47.75 21.75,47.75 20.75,48.75 9.75,48.75 4.75,43.75 4.75,35 v9,30.75
COL7  (via drill 0.3)
  Top 0.203: v33.25,38.75 35.25,40.75 LED58.C 35.5,41 36.25,41.75 v37.25,41.75 | v38.25,44.5 36.25,46.5 35.5,46.5 LED57.C | v37,8.25 35.5,6.75 LED64.C | v37,10.75 35.5,12.25 LED63.C | v37,18 35.5,18 LED62.C | v35.25,22.5 35.25,23.75 LED61.C | v32.5,29.25 35.25,29.25 LED60.C | v32.5,35 35.25,35 LED59.C
  Bottom 0.203: v33.25,38.75 33,38.75 31.75,37.5 IC3.2 32,37.25 32,35.5 v32.5,35 v32.5,29.25 32.5,25.25 v35.25,22.5 35.75,22.5 36,22.75 36.5,22.75 37,22.25 v37,18 v37,10.75 v37,8.25 | v38.25,44.5 38.25,44 38,43.75 38,42.5 v37.25,41.75
COL8  (via drill 0.3)
  Top 0.203: v38,13 38.5,12.5 39.5,12.5 LED71.C | v38,18.25 39.5,18.25 LED70.C | v38,22.25 39.5,23.75 LED69.C | v36.75,29.5 39.5,29.5 LED68.C | v36.75,35.25 39.5,35.25 LED67.C 39.75,35 41,33.75 66.75,33.75 68,35 68,43.75 66.75,45 65.25,45 61.5,48.75 44.25,48.75 42.25,46.75 39.75,46.75 LED65.C | v35.5,39.25 37,40.75 39.5,40.75 LED66.C | v38,8 39.25,6.75 39.75,6.75 LED72.C
  Bottom 0.203: 33.25,37 33.25,37.25 IC3.1 33.25,37 | 33.25,37 33.25,35.25 | 33.25,35.25 33.25,29.5 | 33.25,29.5 33.25,27.25 38,22.5 v38,22.25 v38,18.25 v38,13 v38,8 | 33.25,29.5 v36.75,29.5 | 33.25,35.25 v36.75,35.25 | 33.25,37 v35.5,39.25
COL9  (via drill 0.3)
  Top 0.203: v45.25,12.5 44,12.5 LED79.C 43.75,12.25 42.25,10.75 v39,10.75 | v45.25,17.5 44.5,17.5 44,18 LED78.C | v46.25,21.5 44,23.75 LED77.C 43.75,24 v42.5,25.25 | v39,8 40.5,8 41.75,6.75 44,6.75 LED80.C | v42,31.25 43.75,29.5 LED76.C 44,29.25 v42.5,27.75 | v42,35.25 43.75,35.25 LED75.C | v42,39 43.75,40.75 LED74.C | v49.5,44.5 48.5,44.5 46.5,46.5 44,46.5 LED73.C
  Bottom 0.203: v45.25,12.5 v45.25,17.5 46.25,18.5 v46.25,21.5 | v39,10.75 v39,8 | v42,31.25 v42,35.25 42,37.25 IC4.3 42,37.5 v42,39 42.25,39.25 45,39.25 47,41.25 47,42.25 49.25,44.5 v49.5,44.5 | v42.5,27.75 v42.5,25.25
COL10  (via drill 0.3)
  Top 0.203: LED87.C 48.25,12.5 v47.25,13.5 47,13.75 v35,13.75 | v47,18.25 48.25,18.25 LED86.C | v48.25,22.5 48.25,23.75 LED85.C | v47.25,28.25 48.25,29.25 LED84.C | v35,8 33.5,6.5 33.5,5.5 34,5 45.25,5 46.75,6.5 48.25,6.5 LED88.C | v46.25,35 48.25,35 LED83.C | v46.25,38.75 48.25,40.75 LED82.C 48.5,41 49.5,42 57.25,42 58,42.75 v59,42.75 | v59,44.5 52.75,44.5 50.75,46.5 48.5,46.5 LED81.C
  Bottom 0.203: 47.25,18.25 47.25,21.75 47.5,22 47.5,22.5 | 47.25,18.25 v47.25,13.5 | 47.5,28.25 47.5,29.75 44.25,33 | 47.5,28.25 47.5,22.5 | 44.25,33 43.25,34 43.25,37.25 IC4.2 43.25,37.5 43.25,38 44,38.75 v46.25,38.75 | 47.25,18.25 v47,18.25 | 47.5,22.5 v48.25,22.5 | 47.5,28.25 v47.25,28.25 | v35,13.75 v35,8 | 44.25,33 v46.25,35 | v59,42.75 v59,44.5
COL11  (via drill 0.3)
  Top 0.203: v55.25,14.25 53.5,12.5 52.75,12.5 LED95.C | v54,17.25 53.5,17.25 52.75,18 LED94.C 52.5,18.25 52,18.25 v50.75,19.5 | v58.75,8.25 56.75,8.25 55.25,6.75 53,6.75 LED96.C | 51.5,24 52.5,24 LED93.C | v51,24.5 51.5,24 | v51,29.5 52.5,29.5 LED92.C | v50.75,35 52.5,35 LED91.C | 50.75,39 52.5,40.75 LED90.C | v54.5,47.25 54,46.75 52.75,46.75 LED89.C | v62.75,41.75 62.75,40.5 61.25,39 50.75,39 | 50.75,39 v50.5,38.75 | 51.5,24 v53,22.5
  Bottom 0.203: 55.25,15 55.25,16 v54,17.25 | 55.25,15 v55.25,14.25 | v58.75,8.25 58.75,11.5 55.25,15 | v51,24.5 v51,29.5 51,31.25 49,33.25 | 47,35.25 45,37.25 44.5,37.25 IC4.1 | 47,35.25 49,33.25 | 49,33.25 v50.75,35 | 47,35.25 v50.5,38.75 | v54.5,47.25 57.25,47.25 v62.75,41.75 | v50.75,19.5 50.75,20.25 v53,22.5
COL12  (via drill 0.3)
  Top 0.203: v54.25,35.25 56.75,35.25 LED99.C | v54.25,39.75 55.25,40.75 56.75,40.75 LED98.C 57,40.75 v58.25,42 | v58.25,45.25 57,46.5 LED97.C | v59.25,18.25 57,18.25 LED102.C | v59.25,21.5 57,23.75 LED101.C | v59.5,27.25 57.5,29.25 57,29.25 LED100.C 57,29.5 v57,31 | LED103.C 57,12.25 v59,12.25 59.5,12.25 61.25,10.5 66.25,10.5 66.75,10 66.75,8.75 65.75,7.75 64.5,7.75 62.5,5.75 58,5.75 57.25,6.5 LED104.C
  Bottom 0.203: v54.25,39.75 52.5,38 52.5,37.5 IC5.3 52.25,37.25 v54.25,35.25 54.25,33.75 v57,31 | v58.25,42 v58.25,45.25 | v59.5,27.25 59.5,21.75 v59.25,21.5 v59.25,18.25 59.25,12.5 v59,12.25
COL13  (via drill 0.3)
  Top 0.203: v62.5,11.25 61.5,12.25 LED111.C | v62.5,8 61.25,6.75 LED112.C | v62.5,17 61.5,18 LED110.C 61.25,18.25 v60.25,19.25 | v60.25,25 61.25,24 LED109.C 61.5,23.75 v61.5,22 | v60.5,27.75 60.5,28.5 60.75,28.75 | 60.75,28.75 61.25,29.25 LED108.C | 67.5,42.5 67.5,43.5 66.5,44.5 63.5,44.5 61.5,46.5 LED105.C | 67.5,42.5 67.5,35.25 66.5,34.25 64.75,34.25 64,35 61.5,35 LED107.C | 67.5,42.5 62.25,42.5 61.5,41.75 61.5,41 LED106.C 61.25,40.75 60.25,39.75 v55.5,39.75 | v58.25,31.25 60.75,28.75
  Bottom 0.203: v62.5,8 v62.5,11.25 v62.5,17 | v60.25,25 60.25,27.5 v60.5,27.75 | v55.5,39.75 53.75,38 53.75,37.5 IC5.2 53.5,37.25 55,35.75 55,35 58.25,31.75 v58.25,31.25 | v60.25,19.25 60.25,20.75 v61.5,22
COL14  (via drill 0.3)
  Top 0.203: 66,36.5 67,37.5 67,39.5 65.75,40.75 LED114.C | 66,36.5 65.75,36.25 65.75,35.25 LED115.C | 66,36.5 v57.75,36.5 | LED120.C 66,6.75 66,7.25 67.25,8.5 67.25,10.75 65.75,12.25 LED119.C 65.75,12.5 65.75,13.5 66.75,14.5 66.75,17 65.75,18 LED118.C 65.75,18.25 65.75,19 67.75,21 67.75,22.25 65.75,24.25 | 65.75,24.25 65.75,24.75 66.75,25.75 66.75,28.25 65.75,29.25 | 65.75,24.25 65.75,24 LED117.C 65.75,24.25 | 65.75,29.25 68.5,32 68.5,44 67,45.5 66.75,45.5 65.75,46.5 LED113.C | 65.75,29.25 LED116.C 65.5,29.5 64.5,30.5 61,30.5 60,31.5 v59.25,31.5
  Bottom 0.203: IC5.1 55,37.25 57,37.25 v57.75,36.5 57.75,33 v59.25,31.5
GND  (via drill 0.3)
  Top 0.203: v65.5,31 64.25,31 v63.75,31.5
  Bottom 0.203: 56.75,9.25 57.5,9.25 C13.1 | 56.75,9.25 56.5,9 56,9 IC6.21 55.75,8.75 48.5,8.75 48,8.25 47.25,8.25 IC6.3 47,8 46.25,8 | 46.25,8 45,6.75 45,5.75 42.25,3 R17.1 | 46.25,8 46.25,9.5 46.5,9.75 47,9.75 IC6.5 | 56.75,9.25 58.5,7.5 59,7.5 59.75,8.25 59.75,15.25 62.25,17.75 63.25,17.75 IC7.8 63.5,18 65.25,18 66.25,19 66.25,30.25 v65.5,31 | C5.2 38.25,27.25 39.75,25.75 C6.2 | 40.5,36 40.5,29.75 38.25,27.5 C5.2 | 40.5,36 40.5,37.25 IC4.4 | C11.1 40.25,10.75 40.25,12 C12.1 40,12.25 39.25,13 39.25,17.75 41.5,20 | 41.5,20 43.25,21.75 45,21.75 46.5,23.25 U1.1 | 41.5,20 41.25,20 37.25,24 37.25,26.5 38,27.25 C5.2 | 46.25,45.25 52.5,45.25 53.5,46.25 55.75,46.25 56.5,45.5 C10.2 56.75,45.25 57.5,44.5 57.5,40.5 | 60,40.5 61.75,40.5 62,40.25 C2.2 62.25,40.25 64,40.25 C3.2 | 60,40.5 57.5,40.5 | 57.5,40.5 53.75,40.5 51.25,38 51.25,37.5 IC5.4 | 60,40.5 D1.A | 11.25,40.5 10.25,40.5 8,38.25 8,37.5 IC1.4 | 11.25,40.5 15.5,36.25 17.5,36.25 18.5,37.25 IC2.4 | C14.2 61.25,31 62.75,32.5 | 63.5,33.25 62.75,32.5 | 63.5,33.25 65.25,33.25 X1.GND | 23.25,46.25 23.75,45.75 C7.2 | 23.25,46.25 23,46.5 15.25,46.5 14.25,45.5 13.75,45.5 C4.2 13.75,45.25 14.5,44.5 14.5,42.75 14.25,42.5 12.75,42.5 11.25,41 11.25,40.5 | 23.25,46.25 25.5,46.25 | 25.5,46.25 34,46.25 34.75,45.5 C8.2 | 25.5,46.25 25.5,39 28.25,36.25 28.75,36.25 29.25,36.75 29.25,37.25 IC3.4 | 63.5,33.25 61.75,35 61.75,37 62.25,37.5 64.75,37.5 65.5,38.25 65.5,41.25 58.25,48.5 38,48.5 35.25,45.75 | 35.25,45.75 35,45.5 C8.2 | 46.25,45.25 45.25,46.25 42.75,46.25 42.25,45.75 36.5,45.75 | 35.25,45.75 36.5,45.75 | 46.25,45.25 C9.2 | 35.25,45.75 C8.2 | 40.5,36 38,36 36.5,37.5 36.5,45.75
  Bottom 0.203: 62.75,32.5 v63.75,31.5
LEDATA1  (via drill 0.3)
  Top 0.203: v28.5,37 30,37 30.25,36.75 v38.25,36.75
  Bottom 0.203: R7.1 28.75,41 28.75,37.25 v28.5,37 | v38.25,36.75 38.25,37.5 39,38.25 R11.1
LEDDATA0  (via drill 0.3)
  Top 0.203: v14.5,25.25 22.75,25.25 v24.75,23.25
  Bottom 0.203: TP1.TP 27,9.25 25,9.25 Q1.3 24.75,9.5 v24.75,23.25 | v14.5,25.25 14.5,26.25 5.25,35.5 5.25,40.75 6.25,41.75 R2.1
LEDROW0  (via drill 0.3)
  Top 0.203: LED1.A 9.26,43.63 LED9.A 10.5,43.57 | 10.5,43.57 LED17.A LED25.A LED33.A LED41.A LED49.A LED57.A LED65.A LED73.A LED81.A LED89.A LED97.A LED105.A LED113.A | v48.75,19.5 43,19.5 40.25,16.75 v14.5,16.75 | v7.5,47.5 10.25,47.5 10.5,47.25 10.5,43.57 | 10.5,43.5 10.5,43.57
  Bottom 0.203: v48.75,19.5 54.75,25.5 57,25.5 IC7.15 | v14.5,16.75 14.5,24.25 4.25,34.5 4.25,44.25 v7.5,47.5
LEDROW1  (via drill 0.3)
  Top 0.203: LED2.A 9.26,37.93 LED10.A LED18.A LED26.A LED34.A LED42.A LED50.A LED58.A LED66.A LED74.A LED82.A LED90.A LED98.A LED106.A LED114.A 65.75,38 66.25,38.5 v66.25,39.25
  Bottom 0.203: v66.25,39.25 66.5,39 66.5,33 63.5,30 63.5,27 IC7.1
LEDROW2  (via drill 0.3)
  Top 0.203: LED3.A 9.26,32.23 LED11.A LED19.A LED27.A LED35.A LED43.A | LED43.A 27.02,32.18 27.2,32 26.81,32 LED43.A | LED43.A LED51.A LED59.A LED67.A LED75.A LED83.A LED91.A LED99.A LED107.A 62.5,32.18 | 62.5,32.18 LED115.A | 62.5,32.18 v62.5,31.25 | 62.5,32.25 62.5,32.18
  Bottom 0.203: v62.5,31.25 62.5,28.75 61.75,28 61.75,26.5 62.5,25.75 63.25,25.75 IC7.2
LEDROW3  (via drill 0.3)
  Top 0.203: LED4.A 9.26,26.54 LED12.A LED20.A LED28.A LED36.A LED44.A LED52.A LED60.A LED68.A LED76.A LED84.A LED92.A LED100.A LED108.A | LED108.A LED116.A | v61.5,25.25 61.5,26.25 LED108.A
  Bottom 0.203: v61.5,25.25 62.25,24.5 63.25,24.5 IC7.3
LEDROW4  (via drill 0.3)
  Top 0.203: LED5.A 9.26,20.84 LED13.A LED21.A LED29.A LED37.A | LED37.A 22.61,20.79 22.8,20.6 22.49,20.6 LED37.A | LED37.A LED45.A LED53.A LED61.A LED69.A LED77.A LED85.A LED93.A LED101.A 60.5,20.79 | 60.5,20.79 LED109.A | LED109.A 61.61,20.79 61.8,20.6 61.46,20.6 LED109.A | LED109.A LED117.A | 60.5,20.79 v60.5,22 | 60.5,20.75 60.5,20.79
  Bottom 0.203: v60.5,22 61.5,23 63.25,23 IC7.4
LEDROW5  (via drill 0.3)
  Top 0.203: LED6.A 9.26,15.15 LED14.A LED22.A LED30.A LED38.A LED46.A LED54.A LED62.A LED70.A LED78.A LED86.A LED94.A LED102.A LED110.A 64.5,15.09 | 64.5,15.09 LED118.A | v65,19.5 64.5,19 64.5,15.09 | 64.5,15 64.5,15.09
  Bottom 0.203: v65,19.5 65,20.75 64,21.75 63.5,21.75 IC7.5
LEDROW6  (via drill 0.3)
  Top 0.203: LED23.A LED31.A LED39.A LED47.A LED55.A LED63.A LED71.A LED79.A LED87.A LED95.A LED103.A LED111.A LED119.A 65.5,9.5 v64.25,9.5 | LED23.A 13,9.4 | 13,9.4 LED15.A 5.04,9.4 LED7.A | LED23.A 13.5,9.5 13,9.5 13,9.4 | v63.75,17 63.75,17.5 61.75,19.5 v61.5,19.5
  Bottom 0.203: v64.25,9.5 64.25,16.5 v63.75,17 | v61.5,19.5 62.25,20.25 63.25,20.25 IC7.6
LEDROW7  (via drill 0.3)
  Top 0.203: LED8.A 9.46,3.75 LED16.A LED24.A LED32.A LED40.A LED48.A LED56.A LED64.A LED72.A LED80.A LED88.A LED96.A LED104.A LED112.A LED120.A 66,3.75 v67,4.75 | v67,22 v65.5,22
  Bottom 0.203: v65.5,22 65.75,21.75 65.75,19.25 65.25,18.75 64.75,18.75 64.5,19 63.5,19 IC7.7 | v67,4.75 v67,22
MOSFET_STATUS
  Bottom 0.203: Q1.1 22.75,8.25 22.75,7.5 25.05,5.2 R16.2
MOSI  (via drill 0.3)
  Top 0.203: v45.25,33 45,33 44.75,33.25 v25.5,33.25
  Bottom 0.203: TP2.TP 21,10.25 22.5,10.25 Q1.2 22.75,10.25 22.75,22.25 25.5,25 v25.5,33.25 | v45.25,33 49,29.25 49,22.25 48,21.25 48,13 48.5,12.5 53,12.5 53.5,13 53.5,13.5 IC6.15
N$1  (via drill 0.3)
  Top 0.203: v7,36.75 15.5,36.75 v15.75,37
  Bottom 0.203: v7,36.75 6.25,37.5 6.25,38.25 R1.1 | v15.75,37 15.75,37.75 16.51,38.51 R5.1
N$2
  Bottom 0.203: R1.2 6.25,40.25 7.75,41.75 7.75,43.25 IC1.5
N$3  (via drill 0.3)
  Top 0.203: v15.5,40.5 17,42 v19,42
  Bottom 0.203: v19,42 19.75,42.75 19.75,43.25 IC2.6 | v15.5,40.5 15.61,40.39 R5.2
N$4
  Bottom 0.203: R4.2 17,43.5 18.5,43.5 IC2.5
N$5  (via drill 0.3)
  Top 0.203: v26.25,39.25 25.25,39.25 25,39 19.25,39 v18.75,39.5
  Bottom 0.203: v26.25,39.25 26.5,39 27.75,39 R8.1 | v18.75,39.5 18.75,40 17,41.75 R4.1
N$6
  Bottom 0.203: R8.2 27.75,40.5 26.75,41.5 26.75,44.25 27,44.5 30,44.5 30.5,44 30.5,43.5 IC3.6
N$7
  Bottom 0.203: R2.2 6.5,43.75 7.25,44.5 8.5,44.5 9,44 9,43.5 IC1.6
N$8
  Bottom 0.203: R9.2 34.75,41.75 33.25,41.75 31.75,43.25 IC3.7
N$9
  Bottom 0.203: R15.1 27.5,3.25 28.75,3.25 29,3 S1.1
N$10
  Bottom 0.203: C11.2 40.25,9 42.5,9 43,9.5 X2.P$2 43.25,9.75 44.75,11.25 47,11.25 IC6.7
N$11
  Bottom 0.203: S2.1 36.75,2.75 38.75,2.75 39.5,2 45.5,2 48.5,5 IC6.32
N$12
  Bottom 0.203: S2.2 40.25,3 42,4.75 R17.2
N$14
  Bottom 0.203: C12.2 40.25,13.75 43,13.75 X2.P$1 43.25,13.5 45,11.75 45.5,11.75 45.75,12 47,12 IC6.8
N$24  (via drill 0.3)
  Top 0.203: v41,41.75 43,41.75 43.5,42.25 v48.25,42.25
  Bottom 0.203: v41,41.75 40.75,41.5 39,41.5 R10.1 | v48.25,42.25 49.25,43.25 R13.1
N$32
  Bottom 0.203: R11.2 39,40.25 40.5,40.25 41.75,41.5 41.75,43.25 IC4.6
N$33
  Bottom 0.203: R12.2 44.25,41.75 43.25,42.75 43.25,43.25 IC4.7
N$34
  Bottom 0.203: R7.2 28,43.5 29.25,43.5 IC3.5
N$35
  Bottom 0.203: R6.2 23.75,41.75 22.25,41.75 21.25,42.75 21.25,43.25 IC2.7
N$36  (via drill 0.3)
  Top 0.203: v10.75,42 v12.25,40.5
  Bottom 0.203: v12.25,40.5 13.25,41.5 R3.2 | v10.75,42 10.75,43.25 IC1.7
N$37
  Bottom 0.203: R13.2 49.75,41.75 51,41.75 52.5,43.25 IC5.6
N$38
  Bottom 0.203: R14.2 56.25,42 54.75,42 53.5,43.25 IC5.7
N$41
  Bottom 0.203: X1.VBUS 65.25,36 63.25,36 F1.2
N$42
  Bottom 0.203: R10.2 39,43.25 40.5,43.25 IC4.5
RCK  (via drill 0.3)
  Top 0.203: v58.5,13.75 v60.5,13.75
  Bottom 0.203: v60.5,13.75 60.5,8.25 58,5.75 55.25,5.75 53.75,7.25 47.25,7.25 IC6.2 | v58.5,13.75 58.5,21 57.75,21.75 57.25,21.75 IC7.12
RES
  Bottom 0.203: R16.1 25.3,3.2 26.25,2.25 29.75,2.25 30.25,2.75 32.5,2.75 S1.2 32.75,2.75 34,1.5 48.25,1.5 51,4.25 51,5 IC6.29
SCK  (via drill 0.3)
  Top 0.203: v51.75,16.5 54.25,16.5 55.5,17.75 v55.5,20
  Bottom 0.203: v51.75,16.5 49.5,14.25 49.5,13.75 IC6.10 | v55.5,20 56.75,20 57,20.25 IC7.11
SCL
  Bottom 0.203: IC6.9 48.75,13.75 48.75,14.5 53.5,19.25 57,19.25 IC7.10
SER  (via drill 0.3)
  Top 0.203: v54,18.5 53,19.5 v51.75,19.5
  Bottom 0.203: v54,18.5 53.25,17.75 53.25,17 52,15.75 51.75,15.75 50.5,14.5 50.5,13.75 IC6.11 | v51.75,19.5 56.5,24.25 57,24.25 IC7.14
SHIFT_G  (via drill 0.3)
  Top 0.203: v45.75,6.5 45,5.75 v34.25,5.75 | v41.75,19.25 v34.25,19.25 | v50,16.75 v44.25,16.75
  Bottom 0.203: v45.75,6.5 47,6.5 IC6.1 | v34.25,19.25 v34.25,5.75 | v44.25,16.75 v41.75,19.25 | v50,16.75 56.25,23 57,23 IC7.13
VCC  (via drill 0.3)
  Top 0.203: v42.75,45.25 38.5,45.25 37.75,46 | 37.75,46 36.25,47.5 34,47.5 33,46.5 | v32,45.5 33,46.5 | 21,48 29,48 29.5,48.5 31,48.5 33,46.5 | 21,48 v14.5,48 | 21,48 v21,45.75 | v52,25.25 v43.5,25.25 | v53.75,45.5 55.75,47.5 v58.25,47.5 | v38.25,46.5 37.75,46
  Bottom 0.203: R6.1 23.75,43.5 22.5,43.5 IC2.8 22.25,43.5 22.25,45.5 C7.1 22.25,45.75 v21,45.75 | 12,43.5 13.25,43.5 R3.1 | 12,43.5 12,45.25 C4.1 12,45.5 v14.5,48 | 12,43.5 IC1.8 | 44.5,43.5 44.5,45 C9.1 44.5,45.25 v42.75,45.25 | 44.5,43.5 46,43.5 R12.1 | 44.5,43.5 IC4.8 | R9.1 34.75,43.25 33.25,43.25 IC3.8 33.25,43.5 33.25,45.25 C8.1 33.25,45.5 v32,45.5 | 55,43.75 55,43.5 IC5.8 55,43.75 | 55,43.75 55,45.25 C10.1 54.75,45.5 v53.75,45.5 | 55,43.75 56.25,43.75 R14.1 | 60.25,38.25 62,38.25 C2.1 62.25,38.5 64,38.5 C3.1 64.25,38.5 65,39.25 65,40.75 v58.25,47.5 57.75,48 43.75,48 42.25,46.5 v38.25,46.5 | 60.25,38.25 60.25,36 F1.1 60,35.75 60,31.25 59,30.25 57,30.25 v52,25.25 | 60.25,38.25 D1.C | v43.5,25.25 43.5,25 42,23.5 U1.3

### Text on the board
tPlace: Merry Christmas
bPlace: RES | MOSI | MISO | Next | Reset